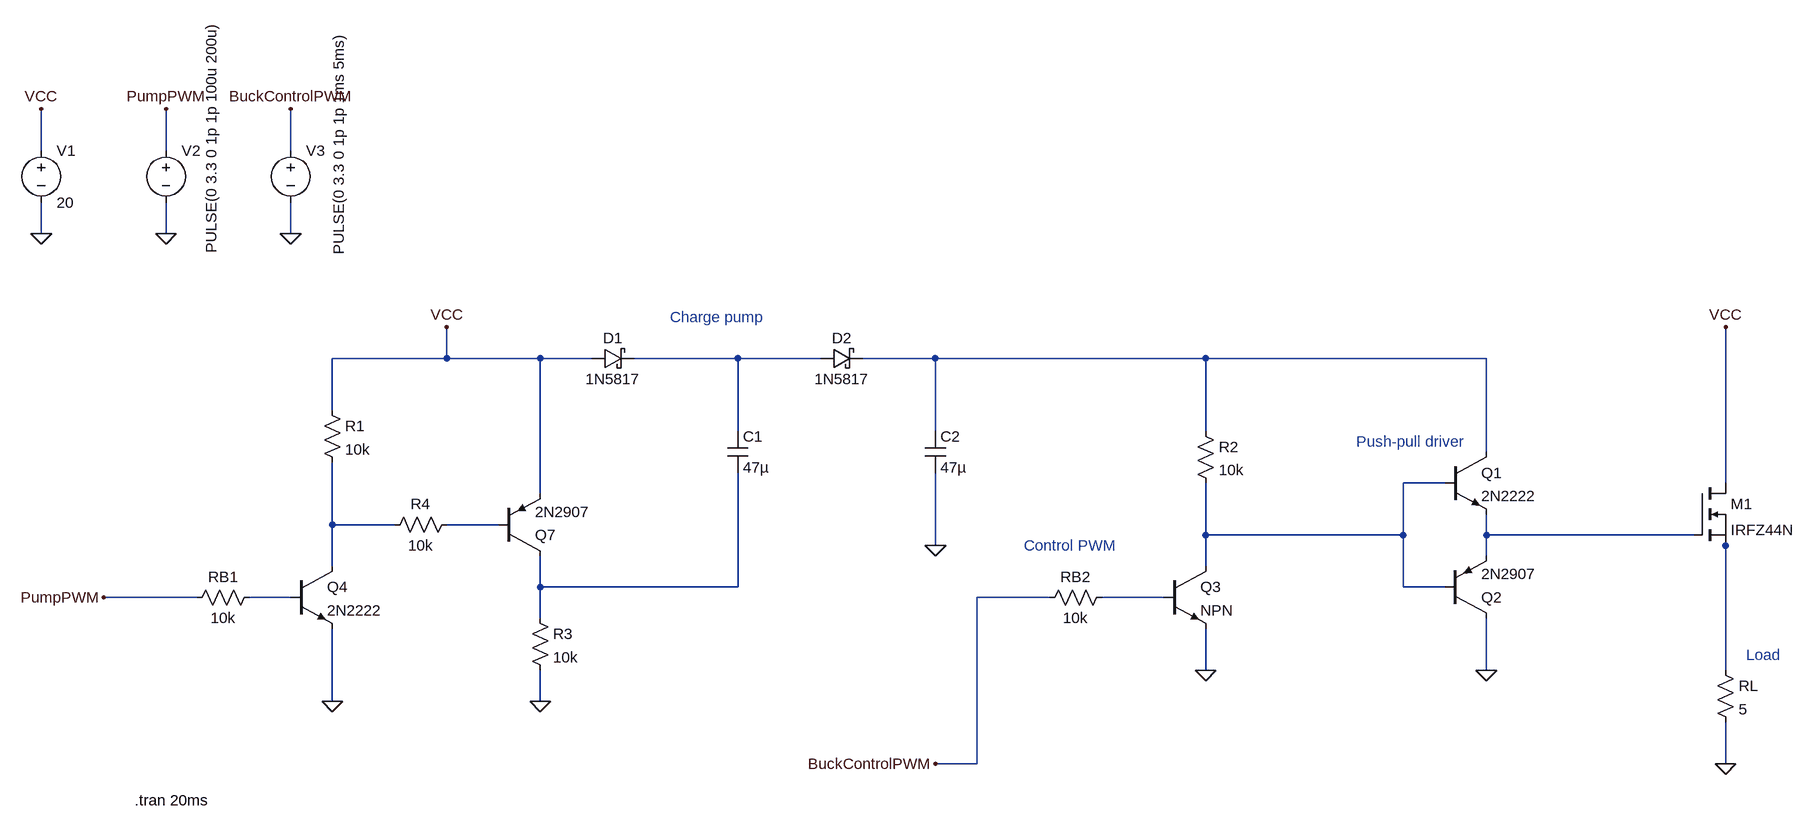
[diagram p0: schematic charge-pump-high-side-nfet-driver.asc]
charge-pump-high-side-nfet-driver.asc, the LTspice schematic file:
Version 4
SHEET 1 4148 776
WIRE -384 -416 -384 -480
WIRE -192 -416 -192 -480
WIRE 0 -416 0 -480
WIRE -384 -288 -384 -336
WIRE -192 -288 -192 -336
WIRE 0 -288 0 -336
WIRE 240 -96 240 -144
WIRE 240 -96 64 -96
WIRE 384 -96 240 -96
WIRE 464 -96 384 -96
WIRE 688 -96 528 -96
WIRE 816 -96 688 -96
WIRE 992 -96 880 -96
WIRE 1408 -96 992 -96
WIRE 1840 -96 1408 -96
WIRE 64 -16 64 -96
WIRE 688 16 688 -96
WIRE 992 16 992 -96
WIRE 1408 16 1408 -96
WIRE 1840 48 1840 -96
WIRE 1776 96 1712 96
WIRE 2208 96 2208 -144
WIRE 384 112 384 -96
WIRE 64 160 64 64
WIRE 160 160 64 160
WIRE 320 160 240 160
WIRE 1408 176 1408 96
WIRE 1712 176 1712 96
WIRE 1712 176 1408 176
WIRE 1840 176 1840 144
WIRE 2160 176 1840 176
WIRE 992 192 992 80
WIRE 2208 192 2208 176
WIRE 1840 208 1840 176
WIRE 64 224 64 160
WIRE 1408 224 1408 176
WIRE 384 256 384 208
WIRE 688 256 688 80
WIRE 688 256 384 256
WIRE 1712 256 1712 176
WIRE 1776 256 1712 256
WIRE -144 272 -288 272
WIRE 0 272 -64 272
WIRE 1168 272 1056 272
WIRE 1344 272 1248 272
WIRE 384 304 384 256
WIRE 1408 384 1408 320
WIRE 1840 384 1840 304
WIRE 2208 384 2208 192
WIRE 64 432 64 320
WIRE 384 432 384 384
WIRE 1056 528 1056 272
WIRE 1056 528 992 528
WIRE 2208 528 2208 464
FLAG -384 -288 0
FLAG -192 -288 0
FLAG 992 192 0
FLAG 2208 528 0
FLAG 1840 384 0
FLAG 0 -288 0
FLAG 1408 384 0
FLAG -384 -480 VCC
FLAG 240 -144 VCC
FLAG 2208 -144 VCC
FLAG -192 -480 PumpPWM
FLAG -288 272 PumpPWM
FLAG 0 -480 BuckControlPWM
FLAG 992 528 BuckControlPWM
FLAG 384 432 0
FLAG 64 432 0
SYMBOL voltage -384 -432 R0
WINDOW 123 0 0 Left 0
WINDOW 39 0 0 Left 0
SYMATTR InstName V1
SYMATTR Value 20
SYMBOL schottky 464 -80 R270
WINDOW 0 32 32 VTop 2
WINDOW 3 0 32 VBottom 2
SYMATTR InstName D1
SYMATTR Value 1N5817
SYMATTR Description Diode
SYMATTR Type diode
SYMBOL schottky 816 -80 R270
WINDOW 0 32 32 VTop 2
WINDOW 3 0 32 VBottom 2
SYMATTR InstName D2
SYMATTR Value 1N5817
SYMATTR Description Diode
SYMATTR Type diode
SYMBOL cap 672 16 R0
SYMATTR InstName C1
SYMATTR Value 47µ
SYMBOL cap 976 16 R0
SYMATTR InstName C2
SYMATTR Value 47µ
SYMBOL voltage -192 -432 R0
WINDOW 123 0 0 Left 0
WINDOW 39 0 0 Left 0
WINDOW 3 70 174 VLeft 2
SYMATTR Value PULSE(0 3.3 0 1p 1p 100u 200u)
SYMATTR InstName V2
SYMBOL res 2192 368 R0
SYMATTR InstName RL
SYMATTR Value 5
SYMBOL nmos 2160 96 R0
SYMATTR InstName M1
SYMATTR Value IRFZ44N
SYMBOL npn 1776 48 R0
SYMATTR InstName Q1
SYMATTR Value 2N2222
SYMBOL pnp 1776 304 M180
SYMATTR InstName Q2
SYMATTR Value 2N2907
SYMBOL voltage 0 -432 R0
WINDOW 123 0 0 Left 0
WINDOW 39 0 0 Left 0
WINDOW 3 74 177 VLeft 2
SYMATTR Value PULSE(0 3.3 0 1p 1p 1ms 5ms)
SYMATTR InstName V3
SYMBOL npn 1344 224 R0
SYMATTR InstName Q3
SYMBOL res 1392 0 R0
SYMATTR InstName R2
SYMATTR Value 10k
SYMBOL res 1264 256 R90
WINDOW 0 0 56 VBottom 2
WINDOW 3 32 56 VTop 2
SYMATTR InstName RB2
SYMATTR Value 10k
SYMBOL npn 0 224 R0
SYMATTR InstName Q4
SYMATTR Value 2N2222
SYMBOL res -48 256 R90
WINDOW 0 0 56 VBottom 2
WINDOW 3 32 56 VTop 2
SYMATTR InstName RB1
SYMATTR Value 10k
SYMBOL res 48 -32 R0
SYMATTR InstName R1
SYMATTR Value 10k
SYMBOL pnp 320 208 M180
SYMATTR InstName Q7
SYMATTR Value 2N2907
SYMBOL res 368 288 R0
SYMATTR InstName R3
SYMATTR Value 10k
SYMBOL res 256 144 R90
WINDOW 0 0 56 VBottom 2
WINDOW 3 32 56 VTop 2
SYMATTR InstName R4
SYMATTR Value 10k
TEXT -240 584 Left 2 !.tran 20ms
TEXT 584 -160 Left 2 ;Charge pump
TEXT 1640 32 Left 2 ;Push-pull driver
TEXT 1128 192 Left 2 ;Control PWM
TEXT 2240 360 Left 2 ;Load

The netlist it stands for:
* charge-pump-high-side-nfet-driver.asc
V1 VCC 0 20
D1 VCC N001 1N5817
D2 N001 N002 1N5817
C1 N001 N008 47µ
C2 N002 0 47µ
V2 PumpPWM 0 PULSE(0 3.3 0 1p 1p 100u 200u)
RL N007 0 5
M1 VCC N006 N007 N007 IRFZ44N
Q1 N002 N003 N006 0 2N2222
Q2 0 N003 N006 0 2N2907
V3 BuckControlPWM 0 PULSE(0 3.3 0 1p 1p 1ms 5ms)
Q3 N003 N010 0 0 NPN
R2 N002 N003 10k
RB2 N010 BuckControlPWM 10k
Q4 N004 N009 0 0 2N2222
RB1 N009 PumpPWM 10k
R1 VCC N004 10k
Q7 N008 N005 VCC 0 2N2907
R3 N008 0 10k
R4 N005 N004 10k
.model D D
.lib standard.dio
.model NPN NPN
.model PNP PNP
.lib standard.bjt
.model NMOS NMOS
.model PMOS PMOS
.lib standard.mos
.tran 20ms
* Charge pump
* Push-pull driver
* Control PWM
* Load
.backanno
.end